# EAGLE design max30105_breakout_iiT (EAGLE 7.7.0)
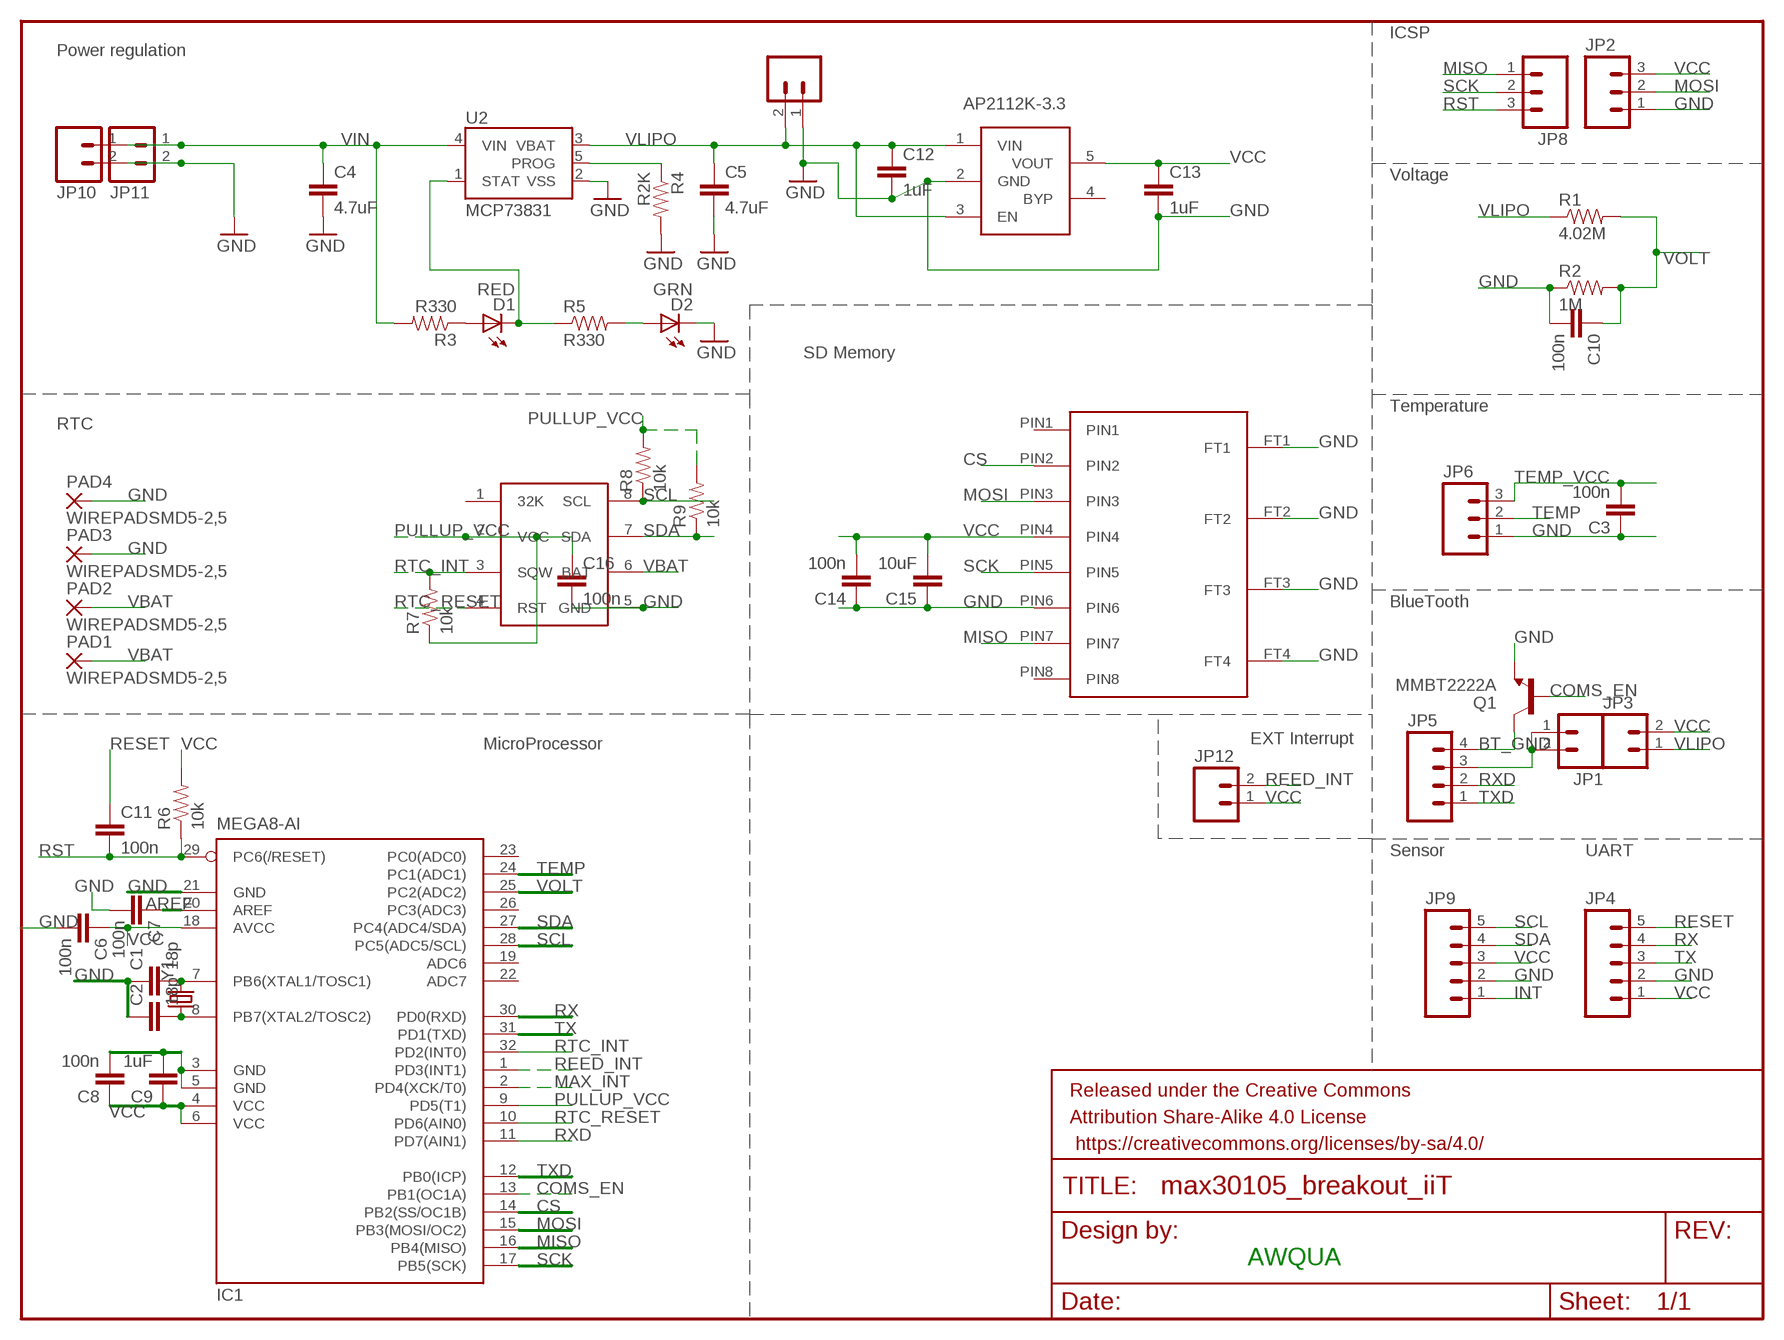
[diagram p0: schematic, sheet 1]

## Parts
*RTC  DS3231M  [DS3231M]
C1  18p  CAP0603-CAP  [0603-CAP]
C2  18p  CAP0603-CAP  [0603-CAP]
C3  100n  CAP0603-CAP  [0603-CAP]
C4  4.7uF  CAP0603-CAP  [0603-CAP]
C5  4.7uF  CAP0603-CAP  [0603-CAP]
C6  100n  CAP0603-CAP  [0603-CAP]
C7  100n  CAP0603-CAP  [0603-CAP]
C8  100n  CAP0603-CAP  [0603-CAP]
C9  1uF  CAP0603-CAP  [0603-CAP]
C10  100n  CAP0603-CAP  [0603-CAP]
C11  100n  CAP0603-CAP  [0603-CAP]
C12  1uF  CAP0603-CAP  [0603-CAP]
C13  1uF  CAP0603-CAP  [0603-CAP]
C14  100n  CAP0603-CAP  [0603-CAP]
C15  10uF  CAP0603-CAP  [0603-CAP]
C16  100n  CAP0603-CAP  [0603-CAP]
D1  RED  LED0603  [LED-0603]
D2  GRN  LED0603  [LED-0603]
FRAME1  FRAME-LETTER  [CREATIVE_COMMONS]
IC1  MEGA8-AI  [TQFP32-08]
JP1  M02PTH  [1X02]
JP2  M03PTH  [1X03]
JP3  M02PTH  [1X02]
JP4  M05PTH  [1X05]
JP5  M04PTH  [1X04]
JP6  M03PTH  [1X03]
JP7  LiPo Battery  M02-JST-2MM-SMT  [JST-2-SMD]
JP8  M03PTH  [1X03]
JP9  M05PTH  [1X05]
JP10  M02PTH  [1X02]
JP11  M02PTH  [1X02]
JP12  M02PTH  [1X02]
MICRO-SD  MICROSD-1010030368  [MICROSD-1010030368]
PAD1  WIREPADSMD5-2,5  [5-2,5]
PAD2  WIREPADSMD5-2,5  [5-2,5]
PAD3  WIREPADSMD5-2,5  [5-2,5]
PAD4  WIREPADSMD5-2,5  [5-2,5]
Q1  MMBT2222A  TRANSISTOR_NPNMMBT2222A  [SOT23-3]
R1  4.02M  RESISTOR0603  [0603-RES]
R2  1M  RESISTOR0603  [0603-RES]
R3  R330  RESISTOR0603-RES  [0603-RES]
R4  R2K  RESISTOR0603-RES  [0603-RES]
R5  R330  RESISTOR0603-RES  [0603-RES]
R6  10k  RESISTOR0603  [0603-RES]
R7  10k  RESISTOR0603  [0603-RES]
R8  10k  RESISTOR0603-RES  [0603-RES]
R9  10k  RESISTOR0603-RES  [0603-RES]
U2  MCP73831  [SOT23-5]
U$6  AP2112K-3.3  LP2985  [LP2985]
Y1  CRYSTAL5X3  [CRYSTAL-SMD-5X3]

## Nets
AREF: C7.1 IC1.20(AREF)
BT_GND: JP5.4 Q1.3(C)
COMS_EN: IC1.13(PB1(OC1A)) Q1.1(B)
CS: IC1.14(PB2(SS/OC1B)) MICRO-SD.PIN2
GND: *RTC.5(GND) C1.1 C2.1 C3.1 C4.2 C5.2 C6.2 C7.2 C8.2 C9.2 C10.2 C12.2 C13.2 C14.1 C15.1 C16.2 D2.C IC1.3(GND) IC1.5(GND) IC1.21(GND) JP2.1 JP4.2 JP6.1 JP7.1 JP9.2 JP10.2 JP11.2 MICRO-SD.FT1 MICRO-SD.FT2 MICRO-SD.FT3 MICRO-SD.FT4 MICRO-SD.PIN6 PAD3.1(P) PAD4.1(P) Q1.2(E) R2.1 R4.2 U2.2(VSS) U$6.2(GND)
INT: JP9.1
MAX_INT: IC1.2(PD4(XCK/T0))
MISO: IC1.16(PB4(MISO)) JP8.1 MICRO-SD.PIN7
MOSI: IC1.15(PB3(MOSI/OC2)) JP2.2 MICRO-SD.PIN3
N$1: D1.A R3.1
N$3: JP1.1 JP1.2 JP5.3
N$5: D2.A R5.2
PROG: R4.1 U2.5(PROG)
PULLUP_VCC: *RTC.2(VCC) C16.1 IC1.9(PD5(T1)) R7.1 R8.2 R9.2
Q1: C2.2 IC1.8(PB7(XTAL2/TOSC2)) Y1.1
Q2: C1.2 IC1.7(PB6(XTAL1/TOSC1)) Y1.3
REED_INT: IC1.1(PD3(INT1)) JP12.2
RESET: C11.1 JP4.5
RST: C11.2 IC1.29(PC6(/RESET)) JP8.3 R6.1
RTC_INT: *RTC.3(SQW) IC1.32(PD2(INT0)) R7.2
RTC_RESET: *RTC.4(RST) IC1.10(PD6(AIN0))
RX: IC1.30(PD0(RXD)) JP4.4
RXD: IC1.11(PD7(AIN1)) JP5.2
SCK: IC1.17(PB5(SCK)) JP8.2 MICRO-SD.PIN5
SCL: *RTC.8(SCL) IC1.28(PC5(ADC5/SCL)) JP9.5 R8.1
SDA: *RTC.7(SDA) IC1.27(PC4(ADC4/SDA)) JP9.4 R9.1
STAT: D1.C R5.1 U2.1(STAT)
TEMP: IC1.24(PC1(ADC1)) JP6.2
TEMP_VCC: C3.2 JP6.3
TX: IC1.31(PD1(TXD)) JP4.3
TXD: IC1.12(PB0(ICP)) JP5.1
VBAT: *RTC.6(BAT) PAD1.1(P) PAD2.1(P)
VCC: C6.1 C8.1 C9.1 C13.1 C14.2 C15.2 IC1.4(VCC) IC1.6(VCC) IC1.18(AVCC) JP2.3 JP3.2 JP4.1 JP9.3 JP12.1 MICRO-SD.PIN4 R6.2 U$6.5(VOUT)
VIN: C4.1 JP10.1 JP11.1 R3.2 U2.4(VIN)
VLIPO: C5.1 C12.1 JP3.1 JP7.2 R1.1 U2.3(VBAT) U$6.1(VIN) U$6.3(EN)
VOLT: C10.1 IC1.25(PC2(ADC2)) R1.2 R2.2
Unconnected: *RTC.1(32K) IC1.19(ADC6) IC1.22(ADC7) IC1.23(PC0(ADC0)) IC1.26(PC3(ADC3)) MICRO-SD.PIN1 MICRO-SD.PIN8 U$6.4(BYP)

## Notes on the sheet
- ICSP
- Power regulation
- AP2112K-3.3
- Voltage
- SD Memory
- Temperature
- RTC
- BlueTooth
- EXT Interrupt
- MicroProcessor
- Sensor | UART
- AWQUA

## Library data of the parts
*RTC = open_source_turbidimeter:DS3231M
C1-C16 = SparkFun:CAP: Capacitor Standard 0603 ceramic capacitor, and 0.1" leaded capacitor.
D1 D2 = SparkFun:LED: LEDs Standard schematic elements and footprints for 5mm, 3mm, 1206, and 0603 sized LEDs. 5mm - Spark Fun Electronics SKU : COM-00529 (and others)
FRAME1 = SparkFun-Aesthetics:FRAME-LETTER: Schematic Frame Standard 8.5x11 US Letter frame
IC1 = atmel:MEGA8: MICROCONTROLLER 8 Kbytes FLASH, 1 kbytes SRAM, 512 bytes EEPROM, USART, 6-channel 10 bit ADC, 2-channel 8 bit ADC Pin compatible with Atmega48, ATMega88, ATMega168 Source: avr.lbr; MPN: ATMEGA8-16AU; OC_FARNELL: 9171371; OC_NEWARK: 73M8863
JP1 JP3 JP10-JP12 = SparkFun-Connectors:M02: Standard 2-pin 0.1" header. Use with - straight break away headers ( PRT-00116) - right angle break away headers (PRT-00553) - swiss pins (PRT-00743) - machine pins (PRT-00117) - female headers (PRT-00115) Molex polarized connector foot print use with: PRT-08233 with associated crimp pins and housings. 2.54_SCREWTERM for use with PRT-10571. 3.5mm Screw Terminal footprints for PRT-08084 5mm Screw Terminal footprints for use with PRT-08432
JP2 JP6 JP8 = SparkFun-Connectors:M03: Header 3 Standard 3-pin 0.1" header. Use with straight break away headers (SKU : PRT-00116), right angle break away headers (PRT-00553), swiss pins (PRT-00743), machine pins (PRT-00117), and female headers (PRT-00115). Molex polarized connector foot print use with SKU : PRT-08232 with associated crimp pins and housings.
JP4 JP9 = SparkFun-Connectors:M05: Header 5 Standard 5-pin 0.1" header. Use with straight break away headers (SKU : PRT-00116), right angle break away headers (PRT-00553), swiss pins (PRT-00743), machine pins (PRT-00117), and female headers (PRT-00115). Molex polarized connector foot print use with SKU : PRT-08230 with associated crimp pins and housings.
JP5 = SparkFun-Connectors:M04: Header 4 Standard 4-pin 0.1" header. Use with straight break away headers (SKU : PRT-00116), right angle break away headers (PRT-00553), swiss pins (PRT-00743), machine pins (PRT-00117), and female headers (PRT-00115). Molex polarized connector foot print use with SKU : PRT-08231 with associated crimp pins and housings. 1MM SMD Version SKU: PRT-10208
JP7 = SparkFun:M02: Header 2 Standard 2-pin 0.1" header. Use with straight break away headers (SKU : PRT-00116), right angle break away headers (PRT-00553), swiss pins (PRT-00743), machine pins (PRT-00117), and female headers (PRT-00115). Molex polarized connector foot print use with SKU : PRT-08233 with associated crimp pins and housings.
MICRO-SD = open_source_turbidimeter:MICROSD-1010030368
PAD1-PAD4 = wirepad:WIREPAD: Wire PAD connect wire on PCB
Q1 = SparkFun-DiscreteSemi:TRANSISTOR_NPN: Generic NPN BJT MMBT2222A - TRANS-08049 (SOT-23, 1A 40V) MPSA42 - TRANS-09116 (SOT-23, 500mA 300V) MMBT5088LT1G - TRANS-11160 (SOT-23, 50 mA 30V) BC547 - COM-08928 <http://www.sparkfun.com/products/8928> (TO-92 45V 100mA) (1.Collector 2.Base 3.Emitter) 2N3904 - COM-00521 <http://www.sparkfun.com/products/521> (TO-92 40V 200mA) (1.Emitter 2.Base 3.Collector) P2N2222A - COM-12852 <http://www.sparkfun.com/products/12852> (TO-92 40V 600mA) (1.Collector 2.Base 3.Emitter); PROD_ID: TRANS-08049
R1 R2 R6 R7 = SparkFun-Resistors:RESISTOR: Resistor Basic schematic elements and footprints for 0603, 1206, and PTH resistors.
R3-R5 R8 R9 = SparkFun:RESISTOR: Resistor Basic schematic elements and footprints for 0603, 1206, and PTH resistors.
U2 = SparkFun:MCP73831: Microchip's MCP73831 Miniature single cell, fully integrated Li-Ion, Li-polymer charge management controller http://ww1.microchip.com/downloads/en/DeviceDoc/21984a.pdf
U$6 = awqua_eagle_library:LP2985
Y1 = SparkFun:CRYSTAL: Crystals Various standard crystals. Proven footprints. Spark Fun Electronics SKU : COM-00534

## Board
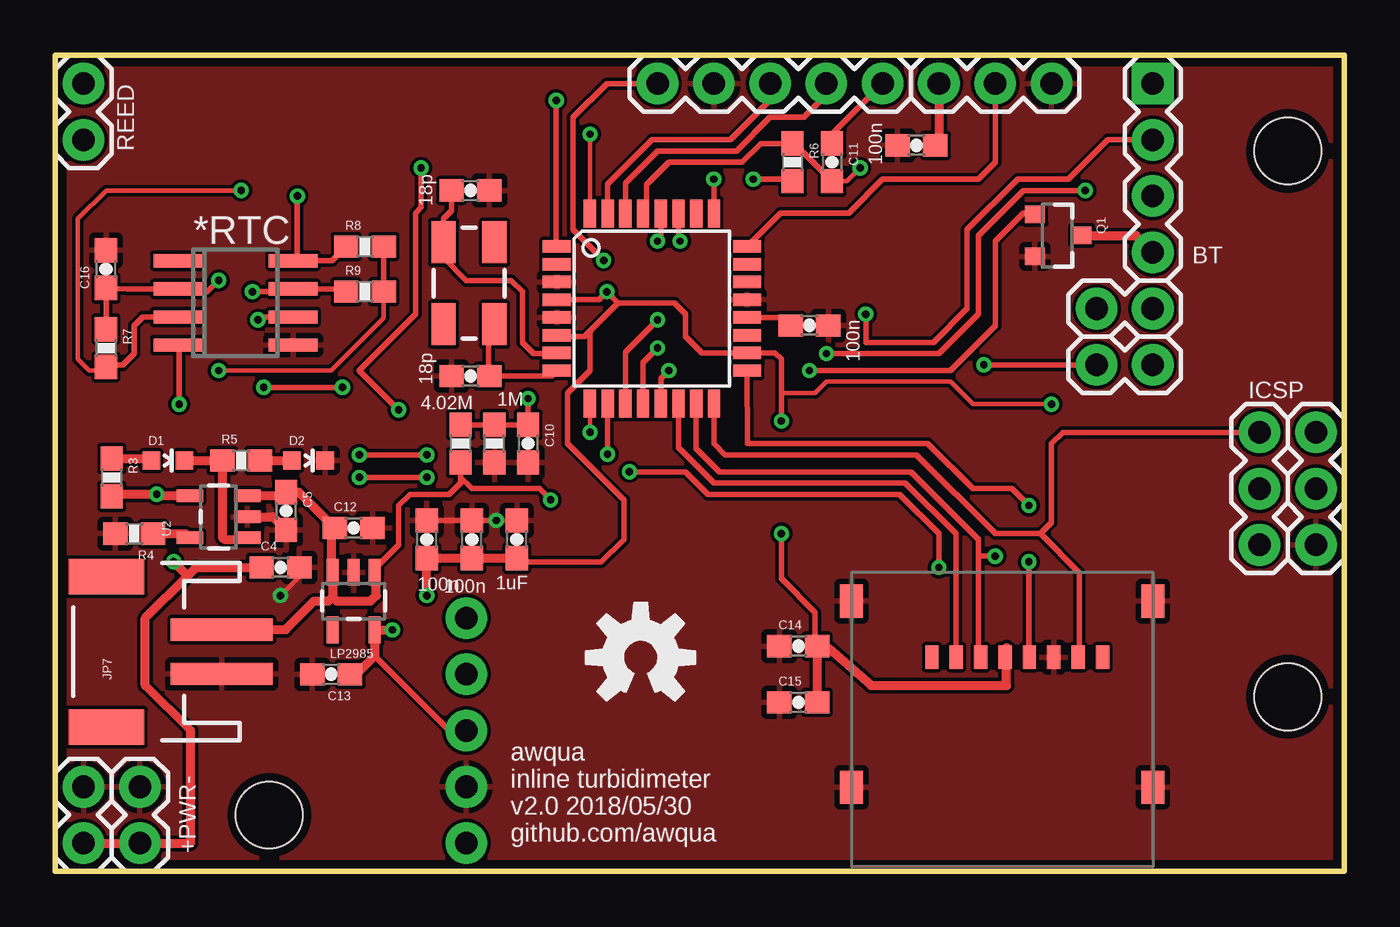
[diagram p1: board, top side]
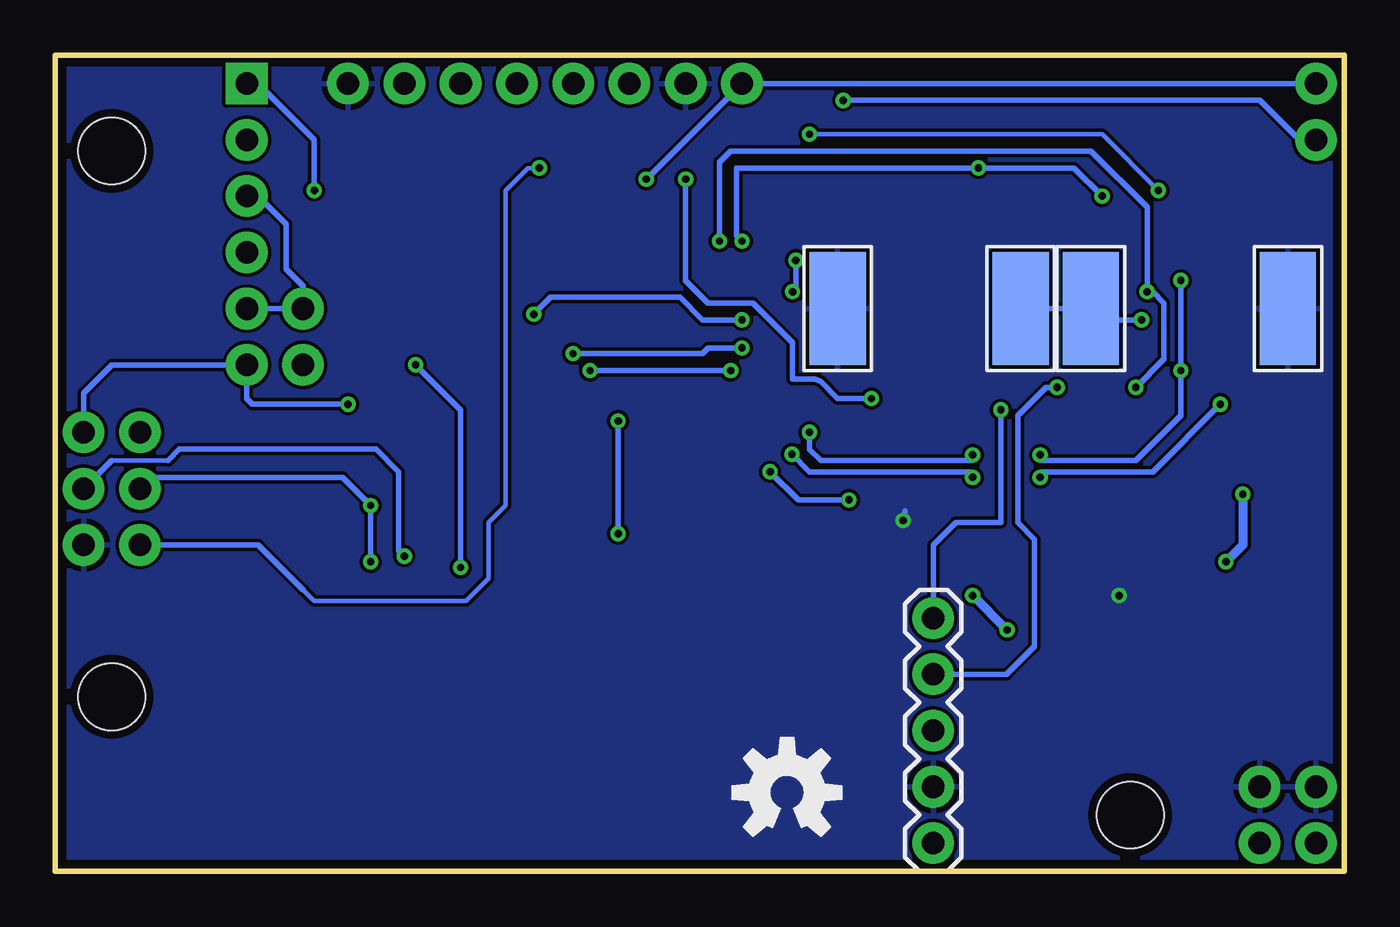
[diagram p2: board, bottom side, seen from below]

Size 58.17 x 36.83 mm. Coordinates in mm from the lower left corner, seen from the top.
Outline: 0,0 58.17,0 58.17,36.83 0,36.83 0,0
Copper layers (1*16): Top 0.0356mm / dielectric 1.5011mm / Bottom 0.0356mm
Design rules "default *": minimum track width 6mil, minimum drill 13mil, track to track 6mil, track to pad 6mil, pad to pad 6mil, via to via 6mil, smd to smd 6mil, copper to edge 15mil, drill to drill 6mil, minimum pad ring 7mil, minimum via ring 7mil, stop-mask expansion 4mil, vias tented up to drill 15mil, thermal gap 10mil
Holes 3 mm at 55.63,32.51 55.63,7.87 9.65,2.54

### Footprints (pad centres in the part's own frame; a part is rotated, then mirrored left to right if it is on the bottom)
DS3231M = smd 2.2 x 0.6: 1 -2.6,1.905; 2 -2.6,0.635; 3 -2.6,-0.635; 4 -2.6,-1.905; 5 2.6,-1.905; 6 2.6,-0.635; 7 2.6,0.635; 8 2.6,1.905
0603-CAP = smd 1.1 x 1: 1 -0.85,0; 2 0.85,0
LED-0603 = smd 0.8 x 0.8: A 0,-0.75; C 0,0.75
TQFP32-08 = smd 1.27 x 0.559: 1 -4.293,2.8; 2 -4.293,2; 3 -4.293,1.2; 4 -4.293,0.4; 5 -4.293,-0.4; 6 -4.293,-1.2; 7 -4.293,-2; 8 -4.293,-2.8; 17 4.293,-2.8; 18 4.293,-2; 19 4.293,-1.2; 20 4.293,-0.4; 21 4.293,0.4; 22 4.293,1.2; 23 4.293,2; 24 4.293,2.8 | smd 0.559 x 1.27: 9 -2.8,-4.293; 10 -2,-4.293; 11 -1.2,-4.293; 12 -0.4,-4.293; 13 0.4,-4.293; 14 1.2,-4.293; 15 2,-4.293; 16 2.8,-4.293; 25 2.8,4.293; 26 2,4.293; 27 1.2,4.293; 28 0.4,4.293; 29 -0.4,4.293; 30 -1.2,4.293; 31 -2,4.293; 32 -2.8,4.293
1X02 = drill 1.016 pad 1.88: 1 0,0; 2 2.54,0
1X03 = drill 1.016 pad 1.88: 1 0,0; 2 2.54,0; 3 5.08,0
1X05 = drill 1.016 pad 1.88: 1 0,0; 2 2.54,0; 3 5.08,0; 4 7.62,0; 5 10.16,0
1X04 = drill 1.016 pad 1.88 square: 1 0,0 | drill 1.016 pad 1.88: 2 2.54,0; 3 5.08,0; 4 7.62,0
JST-2-SMD = smd 1 x 4.6: 1 -1,-3.7; 2 1,-3.7 | smd 1.6 x 3.4: NC1 -3.4,1.5; NC2 3.4,1.5
MICROSD-1010030368 = smd 1.05 x 1.5: FT1 0,8.4; FT2 0,0; FT3 13.6,0; FT4 13.6,8.4 | smd 0.6 x 1.05: PIN1 9.97,2.53; PIN2 8.87,2.53; PIN3 7.77,2.53; PIN4 6.67,2.53; PIN5 5.57,2.53; PIN6 4.47,2.53; PIN7 3.37,2.53; PIN8 2.27,2.53
5-2,5 = smd 2.54 x 5.08: 1 0,0
SOT23-3 = smd 0.8 x 0.9: 1 -0.95,-1; 2 0.95,-1; 3 0,1.1
0603-RES = smd 1.1 x 1: 1 -0.85,0; 2 0.85,0
SOT23-5 = smd 0.55 x 1.2: 1 -0.95,-1.3; 2 0,-1.3; 3 0.95,-1.3; 4 0.95,1.3; 5 -0.95,1.3
LP2985 = smd 0.55 x 1.2: 1 0.32,-0.03; 2 1.27,-0.03; 3 2.22,-0.03; 4 2.22,2.57; 5 0.32,2.57
CRYSTAL-SMD-5X3 = smd 1.9 x 1.1: 1 -1.85,-1.15; 2 1.85,-1.15; 3 1.85,1.15; 4 -1.85,1.15

### Placement (x,y rotation side)
*RTC  8.13,25.65 0 top
C1  18.73,30.73 180 top
C2  18.73,22.35 0 top
C3  38.86,32.77 0 top
C4  10.16,13.72 0 top
C5  10.41,16.26 270 top
C6  18.8,14.99 90 top
C7  34.04,24.64 0 top
C8  16.76,14.99 90 top
C9  20.83,14.99 90 top
C10  21.34,19.3 270 top
C11  35.05,32 270 top
C12  13.46,15.49 0 top
C13  12.45,8.89 180 top
C14  33.53,10.16 0 top
C15  33.53,7.62 0 top
C16  2.29,27.18 90 top
D1  5.08,18.54 270 top
D2  11.43,18.54 270 top
FRAME1  -0.64,-8.89 0 top  (outside the outline)
IC1  26.92,25.4 0 top
JP1  46.99,25.4 0 top
JP2  56.9,14.73 90 top
JP3  46.99,22.86 0 top
JP4  27.18,35.56 0 top
JP5  49.53,35.56 270 top
JP6  44.96,35.56 180 top
JP7  3.81,9.91 90 top
JP8  54.36,19.81 270 top
JP9  18.54,1.27 90 bottom
JP10  1.27,1.27 90 top
JP11  3.81,1.27 90 top
JP12  1.27,35.56 270 top
MICRO-SD  49.53,12.19 180 top
PAD1  11.43,25.4 0 bottom
PAD2  14.61,25.4 0 bottom
PAD3  22.86,25.4 0 bottom
PAD4  2.54,25.4 0 bottom
Q1  45.21,28.7 270 top
R1  18.29,19.3 90 top
R2  19.81,19.3 90 top
R3  2.54,17.78 270 top
R4  3.56,15.24 180 top
R5  8.38,18.54 0 top
R6  33.27,32 270 top
R7  2.29,23.62 270 top
R8  13.97,28.19 0 top
R9  13.97,26.16 0 top
U2  7.37,16 90 top
U$1  [OSHW-LOGO-M]  26.42,9.65 0 top
U$4  [OSHW-LOGO-M]  25.15,3.56 0 bottom
U$6  14.73,13.46 180 top
Y1  18.67,26.54 90 top

### Tracks (layer width: path | path; a pad name or v marks a point on that pad's centre or on a via)
AREF
  Top 0.254: IC1.20 32.82,25 C7.1
BT_GND
  Top 0.406: Q1.3 48.77,28.7 JP5.4
COMS_EN  (via drill 0.33)
  Top 0.254: IC1.13 27.32,22.24 v27.69,22.61 | v34.04,22.61 40.39,22.61 42.42,24.64 42.42,28.45 43.69,29.72 44.15,29.72 Q1.1
  Bottom 0.254: v27.69,22.61 v34.04,22.61
CS
  Top 0.254: IC1.14 28.12,19.12 29.72,17.53 38.35,17.53 40.64,15.24 40.64,10.19 MICRO-SD.PIN2
GND  (via drill 0.33)
  Top 0.203: C4.2 11.01,13.3 v10.16,12.45
  Top 0.254: C8.2 v19.9,15.84
  Top 0.406: U2.2 9.82,16 C5.2
  Bottom 0.203: v10.16,12.45 9.91,12.45
  Bottom 0.254: v19.9,15.84 19.81,16.26
  pour Top: 64.77,-4.83 -6.6,-3.56 -7.37,39.88 64.77,40.64
  pour Bottom: -6.6,39.12 64.52,40.13 65.02,-6.1 -6.1,-6.86
MISO
  Top 0.254: IC1.16 29.72,19.3 30.23,18.8 38.86,18.8 42.42,15.24 44.45,15.24 | 44.45,15.24 46.23,13.46 46.23,10.24 MICRO-SD.PIN7 | 44.45,15.24 44.96,15.75 44.96,19.3 45.47,19.81 JP8.1
MOSI  (via drill 0.33)
  Top 0.254: IC1.15 28.92,19.08 29.97,18.03 38.61,18.03 41.66,14.99 41.66,14.22 | 41.66,14.22 41.66,10.27 MICRO-SD.PIN3 | v42.42,14.22 41.66,14.22
  Bottom 0.203: 55.63,18.54 53.09,18.54
  Bottom 0.254: JP2.2 55.63,18.54 | v42.42,14.22 42.67,14.48 42.67,18.03 43.69,19.05 52.58,19.05 53.09,18.54
N$1
  Top 0.406: R3.1 4.24,18.63 D1.A
N$3
  Bottom 0.254: JP5.3 49.02,30.48 47.75,29.21 47.75,27.18 46.99,26.42 JP1.1 JP1.2
N$5
  Top 0.406: R5.2 D2.A
PROG
  Top 0.406: R4.1 5.88,15.24 U2.5
PULLUP_VCC  (via drill 0.33)
  Top 0.203: IC1.9 24.12,20.07 v24.13,19.81 | R9.2 14.82,24.98 12.45,22.61 v7.37,22.61
  Top 0.254: R7.1 C16.1 3.26,26.29 *RTC.2 5.66,26.16 6.86,26.16 v7.37,26.67 | R8.2 R9.2 | v16.76,18.8 v13.72,18.8
  Bottom 0.203: 24.13,19.05 24.12,19.04
  Bottom 0.254: 24.12,19.04 23.62,18.54 16.76,18.54 v16.76,18.8 | v13.72,18.8 13.72,18.54 9.4,18.54 7.37,20.57 v7.37,22.61 v7.37,26.67 | v24.13,19.81 24.13,19.05
Q1
  Top 0.254: IC1.8 22.38,22.35 C2.2 19.56,22.38 19.56,24.13 19.82,24.39 Y1.1
Q2
  Top 0.254: C1.2 17.88,29.82 17.53,29.46 Y1.3 17.52,27.69 18.54,26.67 20.57,26.67 21.08,26.16 21.08,23.88 21.59,23.37 22.6,23.37 IC1.7
  Top 0.406: C1.2 18.29,30.73
REED_INT  (via drill 0.33)
  Top 0.254: v22.61,34.8 22.61,28.23 IC1.1
  Bottom 0.254: JP12.2 2.03,33.02 3.81,34.8 v22.61,34.8
RESET
  Top 0.254: C11.1 35.05,33.27 JP4.5
RST  (via drill 0.33)
  Top 0.203: C11.2 35.73,31.15 v36.32,31.75
  Top 0.254: IC1.29 26.67,29.84 26.67,30.99 27.69,32 30.99,32 31.84,32.85 R6.1 33.35,32.85 C11.2
  Bottom 0.203: 46.99,12.7 46.48,12.19 39.62,12.19 38.61,13.21 38.61,15.75 37.85,16.51 37.85,30.73 36.83,31.75 v36.32,31.75
  Bottom 0.254: 46.99,12.7 49.02,14.73 JP8.3
RTC_INT  (via drill 0.33)
  Top 0.203: IC1.32 24.12,33.01 24.13,33.02 v24.13,33.27 | v8.38,30.73 2.29,30.73 1.02,29.46 1.02,23.11 1.52,22.61 2.12,22.61 R7.2
  Top 0.254: *RTC.3 3.94,25.02 3.56,24.64 3.56,23.37 3.05,22.86 2.37,22.86 R7.2
  Bottom 0.203: v24.13,33.27 10.92,33.27 v8.38,30.73
RTC_RESET  (via drill 0.33)
  Top 0.254: IC1.10 v24.92,18.83 | v16.76,17.78 v13.72,17.78 | v5.59,21.08 5.59,23.69 *RTC.4
  Bottom 0.254: v24.92,18.83 24.13,18.03 16.76,18.03 v16.76,17.78 | v13.72,17.78 13.72,18.03 8.64,18.03 v5.59,21.08
RX
  Top 0.254: IC1.30 25.72,31.06 27.18,32.51 30.73,32.51 32.26,34.04 33.78,34.04 34.8,35.05 JP4.4
RXD  (via drill 0.33)
  Top 0.254: IC1.11 25.72,23.44 v27.18,24.89 | v36.58,25.15 36.58,23.88 39.62,23.88 41.15,25.4 41.15,28.96 43.43,31.24 45.72,31.24 47.5,33.02 JP5.2
  Bottom 0.254: v27.18,24.89 28.96,24.89 29.97,25.91 35.81,25.91 v36.58,25.15
SCK  (via drill 0.33)
  Top 0.254: IC1.17 31.24,19.3 39.37,19.3 41.4,17.27 43.18,17.27 v43.94,16.51 | v43.94,13.97 43.94,10.19 MICRO-SD.PIN5
  Bottom 0.254: v43.94,13.97 v43.94,16.51 45.21,17.78 53.85,17.78 JP8.2
SCL  (via drill 0.33)
  Top 0.254: IC1.28 27.32,28.59 v27.18,28.45 | v10.92,30.48 10.92,27.75 *RTC.8 12.48,27.56 R8.1 | v16.51,31.75 16.51,29.97 16.26,29.72 16.26,25.15 13.72,22.61 v15.49,20.83
  Bottom 0.254: v10.92,30.48 12.19,31.75 v16.51,31.75 27.43,31.75 27.43,28.7 v27.18,28.45 | v15.49,20.83 15.49,15.75 17.53,15.75 18.54,14.73 JP9.5
SDA  (via drill 0.33)
  Top 0.254: R9.1 12.99,26.29 *RTC.7 10.6,26.16 v8.89,26.16 | IC1.27 28.12,28.52 v28.19,28.45 | v9.4,21.84 v12.95,21.84
  Bottom 0.254: v28.19,28.45 28.19,32 27.69,32.51 11.43,32.51 8.89,29.97 v8.89,26.16 8.64,26.16 8.13,25.65 8.13,23.11 v9.4,21.84 | v12.95,21.84 13.46,21.84 14.73,20.57 14.73,15.75 13.97,14.99 13.97,10.16 15.24,8.89 JP9.4
STAT
  Top 0.406: D1.C R5.1 7.53,15.07 7.62,14.99 8.6,14.99 U2.1
TEMP
  Top 0.254: JP6.2 42.42,32 41.66,31.24 37.34,31.24 35.81,29.72 32.73,29.72 IC1.24
TEMP_VCC
  Top 0.406: JP6.3 39.88,32.93 C3.2
TX
  Top 0.254: IC1.31 24.92,31.02 26.92,33.02 30.48,33.02 32.26,34.8 JP4.3
TXD  (via drill 0.33)
  Top 0.254: IC1.12 26.52,22.97 v27.18,23.62 | v34.8,23.37 39.88,23.37 41.66,25.15 41.66,28.7 43.69,30.73 v46.48,30.73
  Bottom 0.254: v27.18,23.62 28.7,23.62 28.96,23.37 v34.8,23.37 | v46.48,30.73 46.48,33.02 49.02,35.56 JP5.1
VBAT  (via drill 0.33)
  Top 0.254: *RTC.6 9.27,25.02 v9.14,24.89
  Bottom 0.254: v9.14,24.89 10.92,24.89 PAD1.1 PAD2.1
VCC  (via drill 0.33)
  Top 0.203: v44.96,21.08 41.4,21.08 40.39,22.1 34.8,22.1 34.29,21.59 32.77,21.59
  Top 0.254: v32.77,20.32 32.77,21.59 32.77,23.11 32.48,23.4 IC1.18 29.18,23.4 28.45,24.13 28.45,25.15 27.94,25.65 25.4,25.65 | v32.77,15.24 32.77,13.21 34.29,11.68 34.29,10.25 C14.2 | 14.41,9.72 17.78,6.35 JP9.3 | 25.4,25.65 24.13,24.38 | 24.13,24.38 23.88,24.13 22.7,24.13 IC1.6 | 24.13,24.38 24.13,22.61 23.11,21.59 23.11,19.3 25.65,16.76 25.65,14.99 24.64,13.97 20.99,13.97 C9.1 | v31.5,31.24 33.19,31.24 R6.2 | v24.75,27.58 23.37,28.96 23.37,34.04 24.89,35.56 JP4.1 | 25.4,25.65 v24.89,26.16 24.53,25.8 IC1.4
  Top 0.406: MICRO-SD.PIN4 42.93,10.1 42.93,8.38 36.83,8.38 34.89,10.07 C14.2 C15.2 | C13.1 13.58,8.89 14.41,9.72 U$6.5 v15.21,10.89 | v16.76,12.45 C8.1 C6.1 C9.1
  Bottom 0.254: v32.77,20.32 v32.77,15.24 | JP12.1 JP4.1 v31.5,31.24 | v24.75,27.58 24.75,26.31 v24.89,26.16 | v44.96,21.08 49.28,21.08 49.53,21.34 JP3.2 55.63,22.86 56.9,21.59 JP2.3
  Bottom 0.406: v15.21,10.89 v16.76,12.45
VIN  (via drill 0.33)
  Top 0.356: 6.1,6.35 4.06,8.38
  Top 0.406: U2.4 6.04,16.93 4.66,16.93 v4.57,17.02 2.63,17.02 R3.2 2.45,17.02 | JP10.1 JP11.1 6.1,1.27 6.1,6.35 | 4.06,8.38 4.06,11.43 5.97,13.34 | 5.97,13.34 6.35,13.72 C4.1 | v5.33,13.97 5.97,13.34
  Bottom 0.406: v4.57,17.02 4.57,14.73 v5.33,13.97
VLIPO  (via drill 0.33)
  Top 0.254: U$6.1 14.41,13.65 15.49,14.73 15.49,16.51 16,17.02 17.78,17.02 18.29,17.53 R1.1 18.29,17.78 18.8,17.27 21.84,17.27 v22.35,16.76 | v25.91,18.03 28.45,18.03 29.46,17.02 38.1,17.02 39.88,15.24 v39.88,13.72 | JP3.1 v41.91,22.86
  Top 0.406: U2.3 10.26,16.95 C5.1 11,17.11 C12.1 12.61,15.41 12.45,15.24 12.45,13.56 U$6.3 12.51,12.38 | 12.51,12.38 12.7,12.19 14.22,12.19 14.48,12.45 14.48,13.43 U$6.1 | JP7.2 10.4,10.91 11.68,12.19 12.32,12.19 12.51,12.38
  Bottom 0.254: v22.35,16.76 24.64,16.76 v25.91,18.03 | v41.91,22.86 39.88,20.83 v39.88,13.72
VOLT  (via drill 0.33)
  Top 0.254: v29.72,31.24 IC1.25 | R1.2 R2.2 C10.1 v21.34,21.34
  Bottom 0.254: v29.72,31.24 29.72,26.67 28.7,25.65 26.67,25.65 24.89,23.88 24.89,22.23 23.88,22.23 23.62,22.1 22.86,21.34 v21.34,21.34

### Text on the board
tPlace: awqua / inline turbidimeter / v2.0 2018/05/30 / github.com/awqua
tNames: REED | BT | ICSP | +PWR- | AWQUA / Chris Kelley